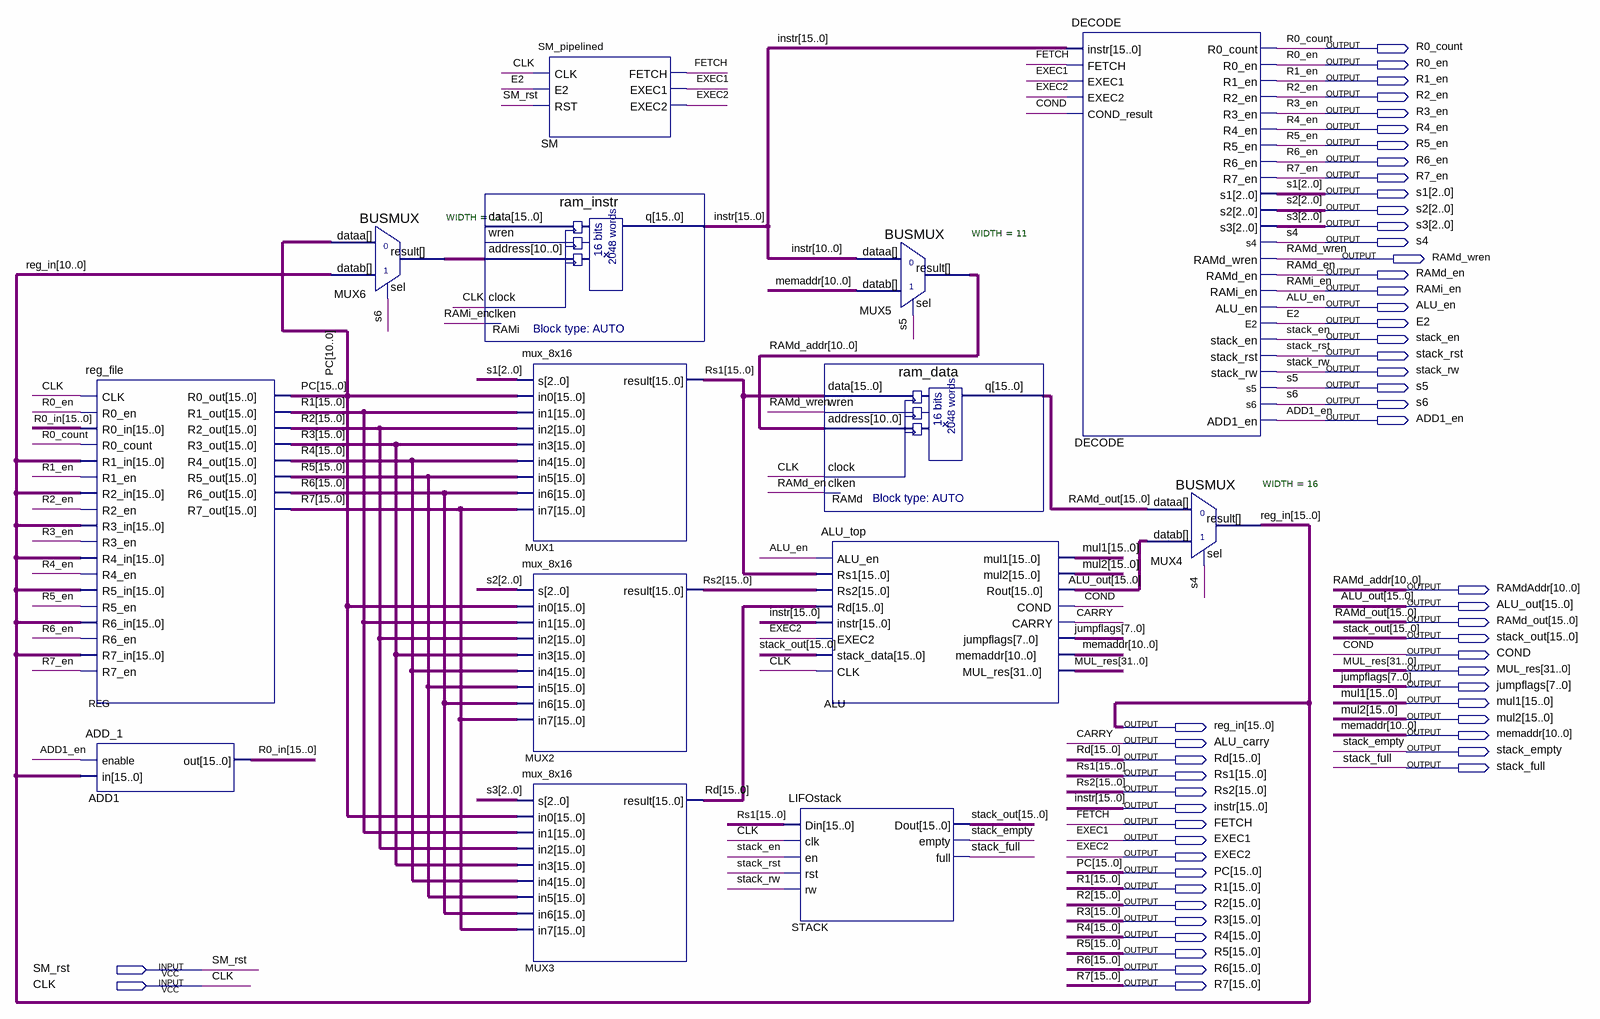
[diagram p0: schematic sheet]
// Quartus schematic CPUProject.bdf as structural Verilog: 14 symbols, 55 pins
module CPUProject (
  input  SM_rst,
  input  CLK,
  output R0_count,
  output R0_en,
  output R1_en,
  output R2_en,
  output R3_en,
  output R4_en,
  output R5_en,
  output R6_en,
  output R7_en,
  output [2:0] s1,
  output [2:0] s2,
  output [2:0] s3,
  output s4,
  output RAMd_wren,
  output RAMd_en,
  output RAMi_en,
  output ALU_en,
  output E2,
  output stack_en,
  output stack_rst,
  output stack_rw,
  output s5,
  output s6,
  output ADD1_en,
  output [10:0] RAMdAddr,
  output [15:0] ALU_out,
  output [15:0] RAMd_out,
  output [15:0] stack_out,
  output COND,
  output [31:0] MUL_res,
  output [7:0] jumpflags,
  output [15:0] mul1,
  output [15:0] mul2,
  output [15:0] reg_in,
  output [10:0] memaddr,
  output ALU_carry,
  output stack_empty,
  output [15:0] Rd,
  output stack_full,
  output [15:0] Rs1,
  output [15:0] Rs2,
  output [15:0] instr,
  output FETCH,
  output EXEC1,
  output EXEC2,
  output [15:0] PC,
  output [15:0] R1,
  output [15:0] R2,
  output [15:0] R3,
  output [15:0] R4,
  output [15:0] R5,
  output [15:0] R6,
  output [15:0] R7
);

  wire [10:0] MUX6_result;
  wire [15:0] R0_in;

  reg_file REG (
    .CLK(CLK), .R0_en(R0_en), .R0_in(R0_in), .R0_count(R0_count), .R1_in(reg_in), .R1_en(R1_en),
    .R2_in(reg_in), .R2_en(R2_en), .R3_in(reg_in), .R3_en(R3_en), .R4_in(reg_in), .R4_en(R4_en),
    .R5_in(reg_in), .R5_en(R5_en), .R6_in(reg_in), .R6_en(R6_en), .R7_in(reg_in), .R7_en(R7_en), .R0_out(PC),
    .R1_out(R1), .R2_out(R2), .R3_out(R3), .R4_out(R4), .R5_out(R5), .R6_out(R6), .R7_out(R7));
  ADD_1 ADD1 (.enable(ADD1_en), .in(reg_in), .out(R0_in));
  BUSMUX #(.WIDTH(11)) MUX6 (.datab(reg_in[10:0]), .sel(s6), .dataa(PC[10:0]), .result(MUX6_result));
  ram_instr RAMi (.address(MUX6_result), .clock(CLK), .clken(RAMi_en), .q(instr));  // open: data, wren
  mux_8x16 MUX1 (.s(s1), .in0(PC), .in1(R1), .in2(R2), .in3(R3), .in4(R4), .in5(R5), .in6(R6), .in7(R7), .result(Rs1));
  mux_8x16 MUX2 (.s(s2), .in0(PC), .in1(R1), .in2(R2), .in3(R3), .in4(R4), .in5(R5), .in6(R6), .in7(R7), .result(Rs2));
  mux_8x16 MUX3 (.s(s3), .in0(PC), .in1(R1), .in2(R2), .in3(R3), .in4(R4), .in5(R5), .in6(R6), .in7(R7), .result(Rd));
  SM_pipelined SM (.CLK(CLK), .E2(E2), .RST(SM_rst), .FETCH(FETCH), .EXEC1(EXEC1), .EXEC2(EXEC2));
  ram_data RAMd (.data(Rs1), .wren(RAMd_wren), .address(RAMdAddr), .clock(CLK), .clken(RAMd_en), .q(RAMd_out));
  ALU_top ALU (
    .ALU_en(ALU_en), .Rs1(Rs1), .Rs2(Rs2), .Rd(Rd), .instr(instr), .EXEC2(EXEC2), .stack_data(stack_out),
    .CLK(CLK), .mul1(mul1), .mul2(mul2), .Rout(ALU_out), .COND(COND), .CARRY(ALU_carry),
    .jumpflags(jumpflags), .memaddr(memaddr), .MUL_res(MUL_res));
  LIFOstack STACK (
    .Din(Rs1), .clk(CLK), .en(stack_en), .rst(stack_rst), .rw(stack_rw), .Dout(stack_out),
    .empty(stack_empty), .full(stack_full));
  BUSMUX #(.WIDTH(11)) MUX5 (.datab(memaddr), .sel(s5), .dataa(instr[10:0]), .result(RAMdAddr));
  DECODE DECODE (
    .instr(instr), .FETCH(FETCH), .EXEC1(EXEC1), .EXEC2(EXEC2), .COND_result(COND), .R0_count(R0_count),
    .R0_en(R0_en), .R1_en(R1_en), .R2_en(R2_en), .R3_en(R3_en), .R4_en(R4_en), .R5_en(R5_en), .R6_en(R6_en),
    .R7_en(R7_en), .s1(s1), .s2(s2), .s3(s3), .s4(s4), .RAMd_wren(RAMd_wren), .RAMd_en(RAMd_en),
    .RAMi_en(RAMi_en), .ALU_en(ALU_en), .E2(E2), .stack_en(stack_en), .stack_rst(stack_rst),
    .stack_rw(stack_rw), .s5(s5), .s6(s6), .ADD1_en(ADD1_en));
  BUSMUX #(.WIDTH(16)) MUX4 (.datab(ALU_out), .sel(s4), .dataa(RAMd_out), .result(reg_in));

  // Other names for the same wires on the sheet: CARRY = ALU_carry; RAMd_addr[10:0] = RAMdAddr
endmodule
